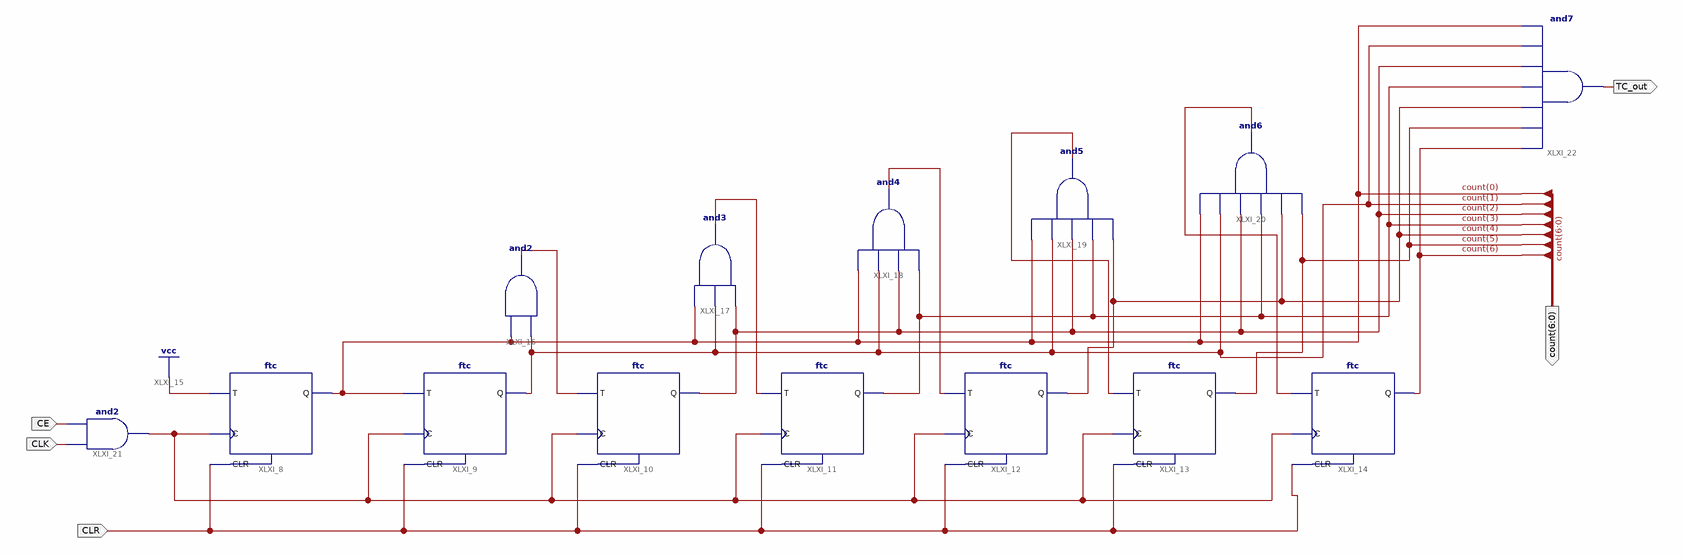
[diagram p0: schematic sheet 1]
// Xilinx ISE schematic counter128.sch (spartan6) as structural Verilog: 14 symbols, 5 ports
module counter128 (
  input  CLR,
  input  CLK,
  input  CE,
  output [6:0] count,
  output TC_out
);

  wire XLXN_14, XLXN_18, XLXN_23, XLXN_28, XLXN_34, XLXN_42;

  ftc XLXI_8 (.C(XLXN_14), .CLR(CLR), .T(1'b1), .Q(count[0]));
  ftc XLXI_9 (.C(XLXN_14), .CLR(CLR), .T(count[0]), .Q(count[1]));
  ftc XLXI_10 (.C(XLXN_14), .CLR(CLR), .T(XLXN_18), .Q(count[2]));
  ftc XLXI_11 (.C(XLXN_14), .CLR(CLR), .T(XLXN_23), .Q(count[3]));
  ftc XLXI_12 (.C(XLXN_14), .CLR(CLR), .T(XLXN_28), .Q(count[4]));
  ftc XLXI_13 (.C(XLXN_14), .CLR(CLR), .T(XLXN_34), .Q(count[5]));
  ftc XLXI_14 (.C(XLXN_14), .CLR(CLR), .T(XLXN_42), .Q(count[6]));
  and XLXI_16 (XLXN_18, count[1], count[0]);
  and XLXI_17 (XLXN_23, count[2], count[1], count[0]);
  and XLXI_18 (XLXN_28, count[3], count[2], count[1], count[0]);
  and XLXI_19 (XLXN_34, count[4], count[3], count[2], count[1], count[0]);
  and XLXI_20 (XLXN_42, count[5], count[4], count[3], count[2], count[1], count[0]);
  and XLXI_21 (XLXN_14, CLK, CE);
  and XLXI_22 (TC_out, count[6], count[5], count[4], count[3], count[2], count[1], count[0]);
endmodule
